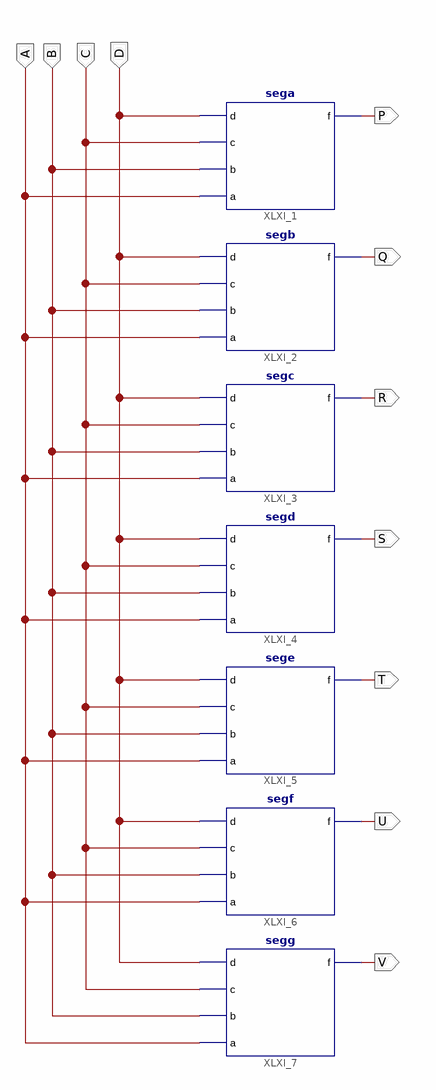
[diagram p0: schematic sheet 1]
// Xilinx ISE schematic test.sch (spartan3e) as structural Verilog: 7 symbols, 11 ports
module test (
  input  D,
  input  C,
  input  B,
  input  A,
  output V,
  output U,
  output T,
  output S,
  output R,
  output Q,
  output P
);

  sega XLXI_1 (.d(D), .c(C), .b(B), .a(A), .f(P));
  segf XLXI_6 (.d(D), .c(C), .b(B), .a(A), .f(U));
  sege XLXI_5 (.d(D), .c(C), .b(B), .a(A), .f(T));
  segg XLXI_7 (.d(D), .c(C), .b(B), .a(A), .f(V));
  segd XLXI_4 (.d(D), .c(C), .b(B), .a(A), .f(S));
  segc XLXI_3 (.d(D), .c(C), .b(B), .a(A), .f(R));
  segb XLXI_2 (.d(D), .c(C), .b(B), .a(A), .f(Q));
endmodule
